# EAGLE design arm shield design (EAGLE 7.2.0)
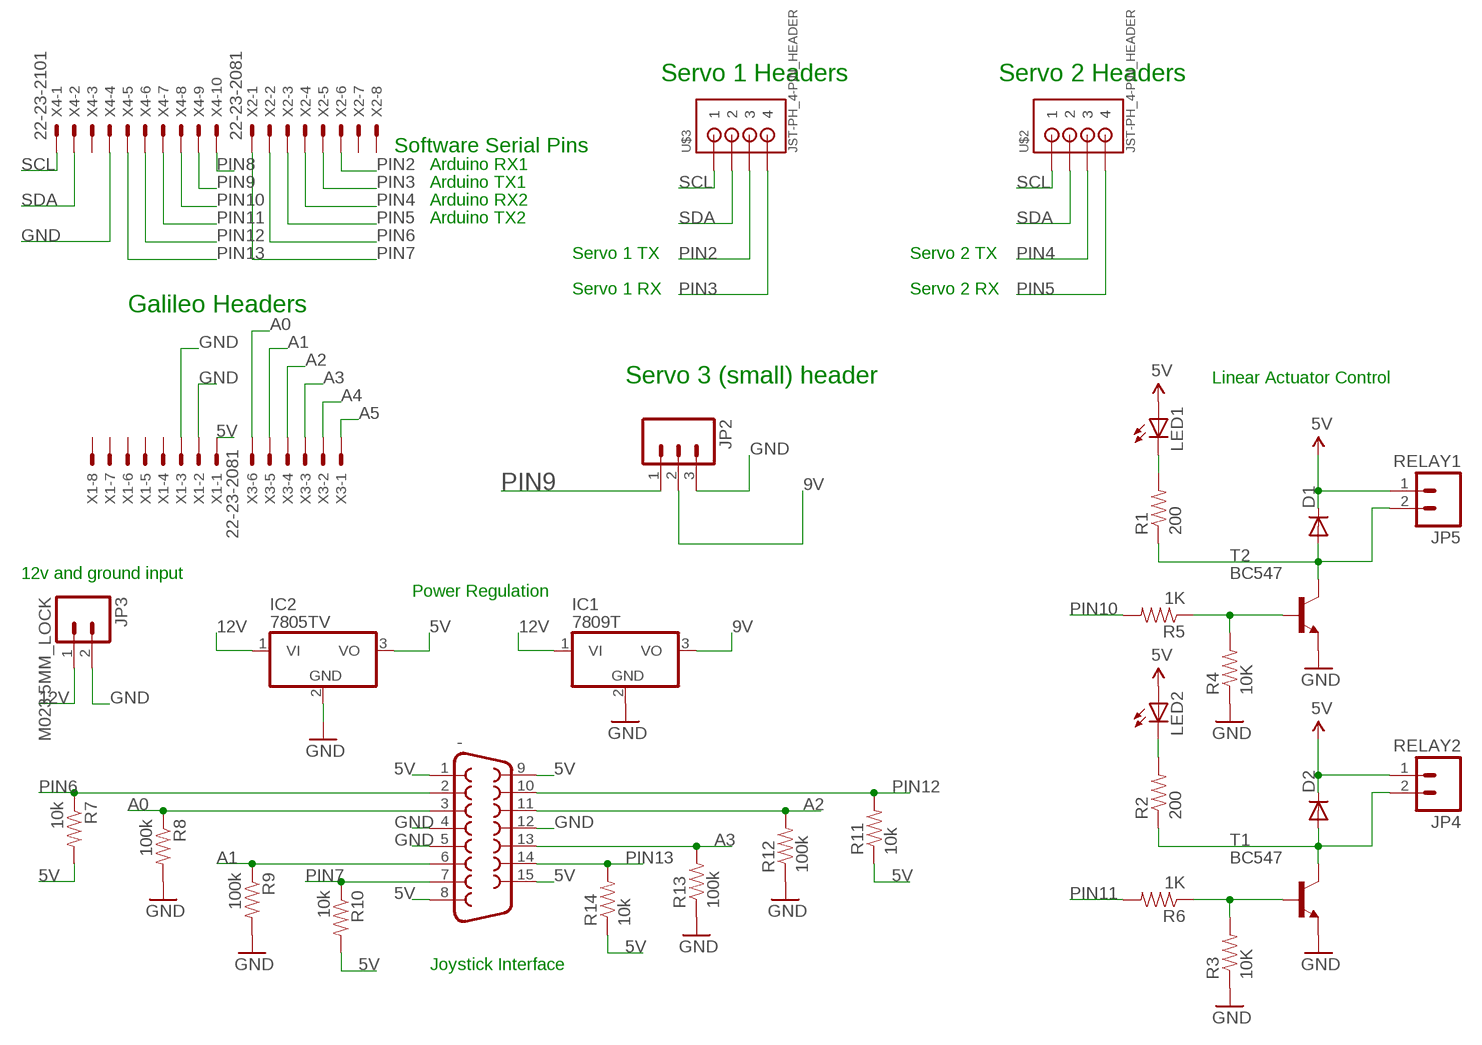
[diagram p0: schematic, sheet 1]

## Parts
-  F15HP  [F15HP]
D1  DIODE1N4148  [DIODE-1N4148]
D2  DIODE1N4148  [DIODE-1N4148]
IC1  7809T  7805TV  [TO220V]
IC2  7805TV  [TO220V]
JP2  M03PTH  [1X03]
JP3  M023.5MM_LOCK  [SCREWTERMINAL-3.5MM-2_LOCK]
JP4  RELAY2  M023.5MM_LOCK  [SCREWTERMINAL-3.5MM-2_LOCK]
JP5  RELAY1  M023.5MM_LOCK  [SCREWTERMINAL-3.5MM-2_LOCK]
LED1  LED3MM  [LED3MM]
LED2  LED3MM  [LED3MM]
R1  200  RESISTORPTH-1/4W-VERT  [AXIAL-0.1]
R2  200  RESISTORPTH-1/4W-VERT  [AXIAL-0.1]
R3  10K  RESISTORPTH-1/4W-VERT  [AXIAL-0.1]
R4  10K  RESISTORPTH-1/4W-VERT  [AXIAL-0.1]
R5  1K  RESISTORPTH-1/4W-VERT  [AXIAL-0.1]
R6  1K  RESISTORPTH-1/4W-VERT  [AXIAL-0.1]
R7  10k  RESISTORPTH-1/4W-VERT  [AXIAL-0.1]
R8  100k  RESISTORPTH-1/4W-VERT  [AXIAL-0.1]
R9  100k  RESISTORPTH-1/4W-VERT  [AXIAL-0.1]
R10  10k  RESISTORPTH-1/4W-VERT  [AXIAL-0.1]
R11  10k  RESISTORPTH-1/4W-VERT  [AXIAL-0.1]
R12  100k  RESISTORPTH-1/4W-VERT  [AXIAL-0.1]
R13  100k  RESISTORPTH-1/4W-VERT  [AXIAL-0.1]
R14  10k  RESISTORPTH-1/4W-VERT  [AXIAL-0.1]
T1  BC547  [TO92]
T2  BC547  [TO92]
U$2  JST-PH_4-PIN_HEADER  [JST_B4B-PH_HEADER]
U$3  JST-PH_4-PIN_HEADER  [JST_B4B-PH_HEADER]
X1  22-23-2081  [22-23-2081]
X2  22-23-2081  [22-23-2081]
X3  22-23-2061  [22-23-2061]
X4  22-23-2101  [22-23-2101]

## Nets
5V: -.1 -.8 -.9 -.15 D1.C D2.C IC2.3(VO) JP4.1 JP5.1 LED1.A LED2.A R7.P$2 R10.P$2 R11.P$1 R14.P$1 X1.1
9V [9VPower]: IC1.3(VO) JP2.2
12V [12VPower]: IC1.1(VI) IC2.1(VI) JP3.1
A0: -.3 R8.P$1 X3.6
A1: -.6 R9.P$1 X3.5
A2: -.11 R12.P$2 X3.4
A3: -.13 R13.P$2 X3.3
A4: X3.2
A5: X3.1
GND [12VPower]: -.4 -.5 -.12 IC1.2(GND) IC2.2(GND) JP2.3 JP3.2 R3.P$1 R4.P$1 R8.P$2 R9.P$2 R12.P$1 R13.P$1 T1.1(E) T2.1(E) X1.2 X1.3 X4.4
N$3: D1.A JP5.2 R1.P$1 T2.3(C)
N$4: D2.A JP4.2 R2.P$1 T1.3(C)
N$5: LED1.K(C) R1.P$2
N$6: R3.P$2 R6.P$1 T1.2(B)
N$7: LED2.K(C) R2.P$2
N$8: R4.P$2 R5.P$1 T2.2(B)
PIN2: U$3.P3 X2.6
PIN3: U$3.P4 X2.5
PIN4: U$2.P3 X2.4
PIN5: U$2.P4 X2.3
PIN6: -.2 R7.P$1 X2.2
PIN7: -.7 R10.P$1 X2.1
PIN8: X4.10
PIN9: JP2.1 X4.9
PIN10: R5.P$2 X4.8
PIN11: R6.P$2 X4.7
PIN12: -.10 R11.P$2 X4.6
PIN13: -.14 R14.P$2 X4.5
SCL: U$2.P1 U$3.P1 X4.1
SDA: U$2.P2 U$3.P2 X4.2
Unconnected: X1.4 X1.5 X1.6 X1.7 X1.8 X2.7 X2.8 X4.3

## Notes on the sheet
- Servo 1 Headers | Servo 2 Headers
- Software Serial Pins
- Arduino RX1
- Arduino TX1
- Arduino RX2
- Arduino TX2
- Servo 1 TX | Servo 2 TX
- Servo 1 RX | Servo 2 RX
- Galileo Headers
- Servo 3 (small) header | Linear Actuator Control
- 12v and ground input
- Power Regulation
- Joystick Interface

## Library data of the parts
- = con-subd:F15: SUB-D; OC_FARNELL: unknown; OC_NEWARK: unknown
D1 D2 = SparkFun-DiscreteSemi:DIODE: Diode These are standard reverse protection diodes and small signal diodes. SMA package can handle up to about 1A. SOD-323 can handle about 200mA. What the SOD-323 package when ordering, there are some mfgs out there that are 5-pin packages.
IC1 IC2 = linear:78*: Positive VOLTAGE REGULATOR Source: http://cache.national.com/ds/LM/LM78L05.pdf http://www.fairchildsemi.com/ds/LM/LM7805.pdf
JP2 = SparkFun-Connectors:M03: Header 3 Standard 3-pin 0.1" header. Use with straight break away headers (SKU : PRT-00116), right angle break away headers (PRT-00553), swiss pins (PRT-00743), machine pins (PRT-00117), and female headers (PRT-00115). Molex polarized connector foot print use with SKU : PRT-08232 with associated crimp pins and housings.
JP3-JP5 = SparkFun-Connectors:M02: Standard 2-pin 0.1" header. Use with - straight break away headers ( PRT-00116) - right angle break away headers (PRT-00553) - swiss pins (PRT-00743) - machine pins (PRT-00117) - female headers (PRT-00115) Molex polarized connector foot print use with: PRT-08233 with associated crimp pins and housings. 2.54_SCREWTERM for use with PRT-10571. 3.5mm Screw Terminal footprints for PRT-08084 5mm Screw Terminal footprints for use with PRT-08433
LED1 LED2 = SparkFun-LED:LED: LEDs Standard schematic elements and footprints for 5mm, 3mm, 1206, and 0603 sized LEDs. 5mm - Spark Fun Electronics SKU : COM-00529 (and others)
R1-R14 = SparkFun-Resistors:RESISTOR: Resistor Basic schematic elements and footprints for 0603, 1206, and PTH resistors.
T1 T2 = transistor:BC547: NPN TRANSISTOR
U$2 U$3 = SRG:JST-PH_4-PIN_HEADER: 4-pin JST PH Shrouded Header, top entry P/N B4B-PH-K-S Mating connector PHR-4 Mating cable assembly: Sparkfun PRT-09916 <http://www.sparkfun.com/products/9916>; MPN: S4B-PH-K-S(LF)(SN)
X1 X2 = con-molex:22-23-2081: .100" (2.54mm) Center Header - 8 Pin; MF: MOLEX; MPN: 22-23-2081; OC_FARNELL: 1756826; OC_NEWARK: 01C7592
X3 = con-molex:22-23-2061: .100" (2.54mm) Center Header - 6 Pin; MF: MOLEX; MPN: 22-23-2061; OC_FARNELL: 1462922; OC_NEWARK: 27C1933
X4 = con-molex:22-23-2101: .100" (2.54mm) Center Header - 10 Pin; MF: MOLEX; MPN: 22-23-2101; OC_FARNELL: 1756828; OC_NEWARK: 94C0765

## Net classes
0 default: width 1.016 mm
1 12VPower: width 2.032 mm
2 9VPower: width 2.032 mm

## Board
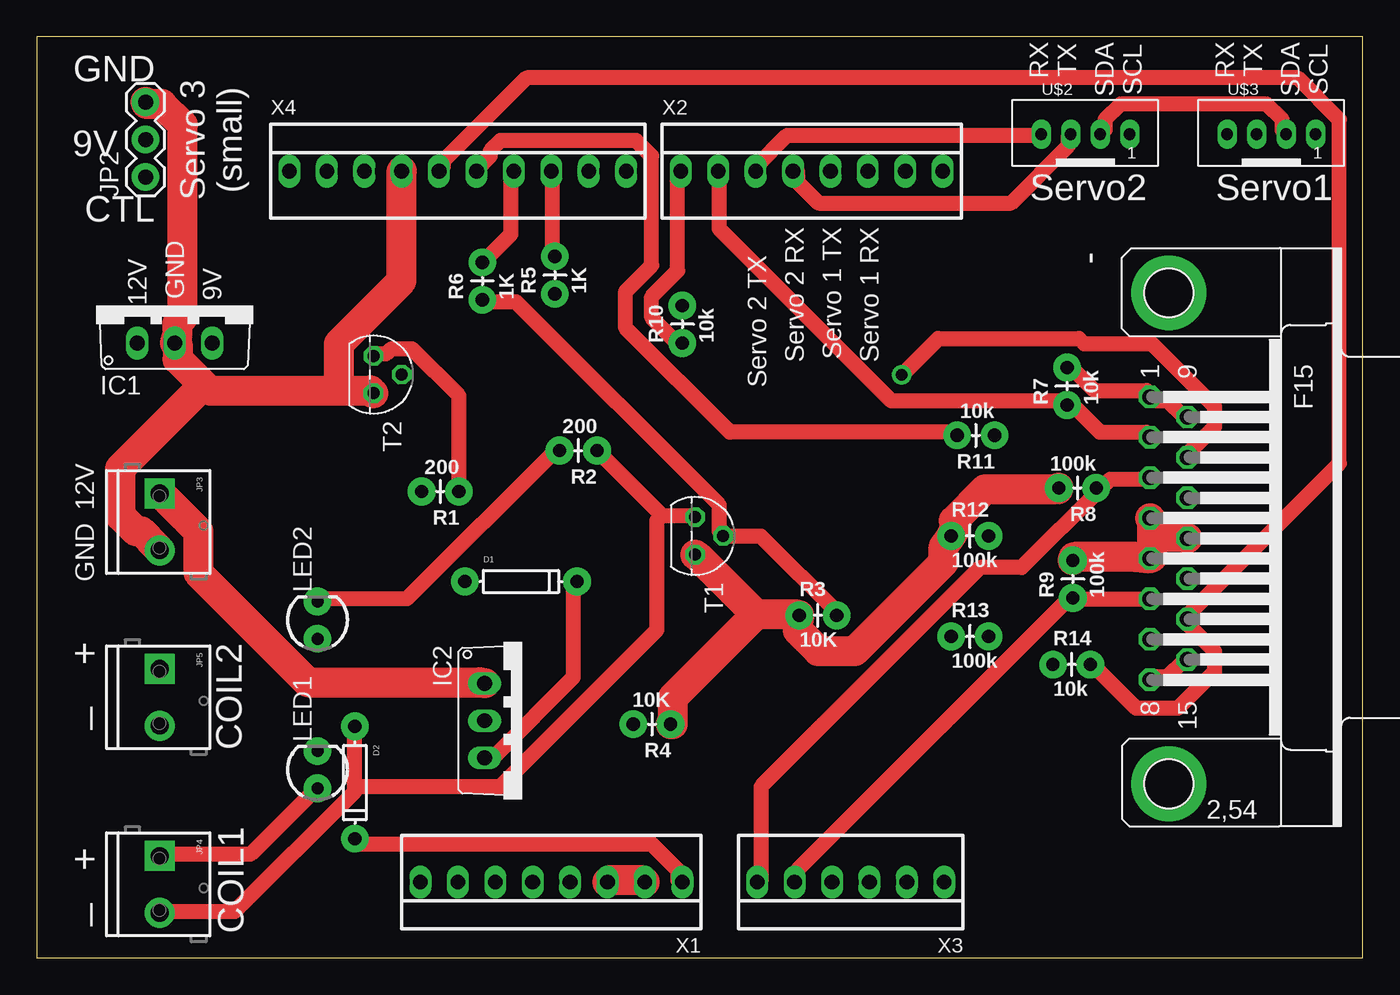
[diagram p1: board, top side]
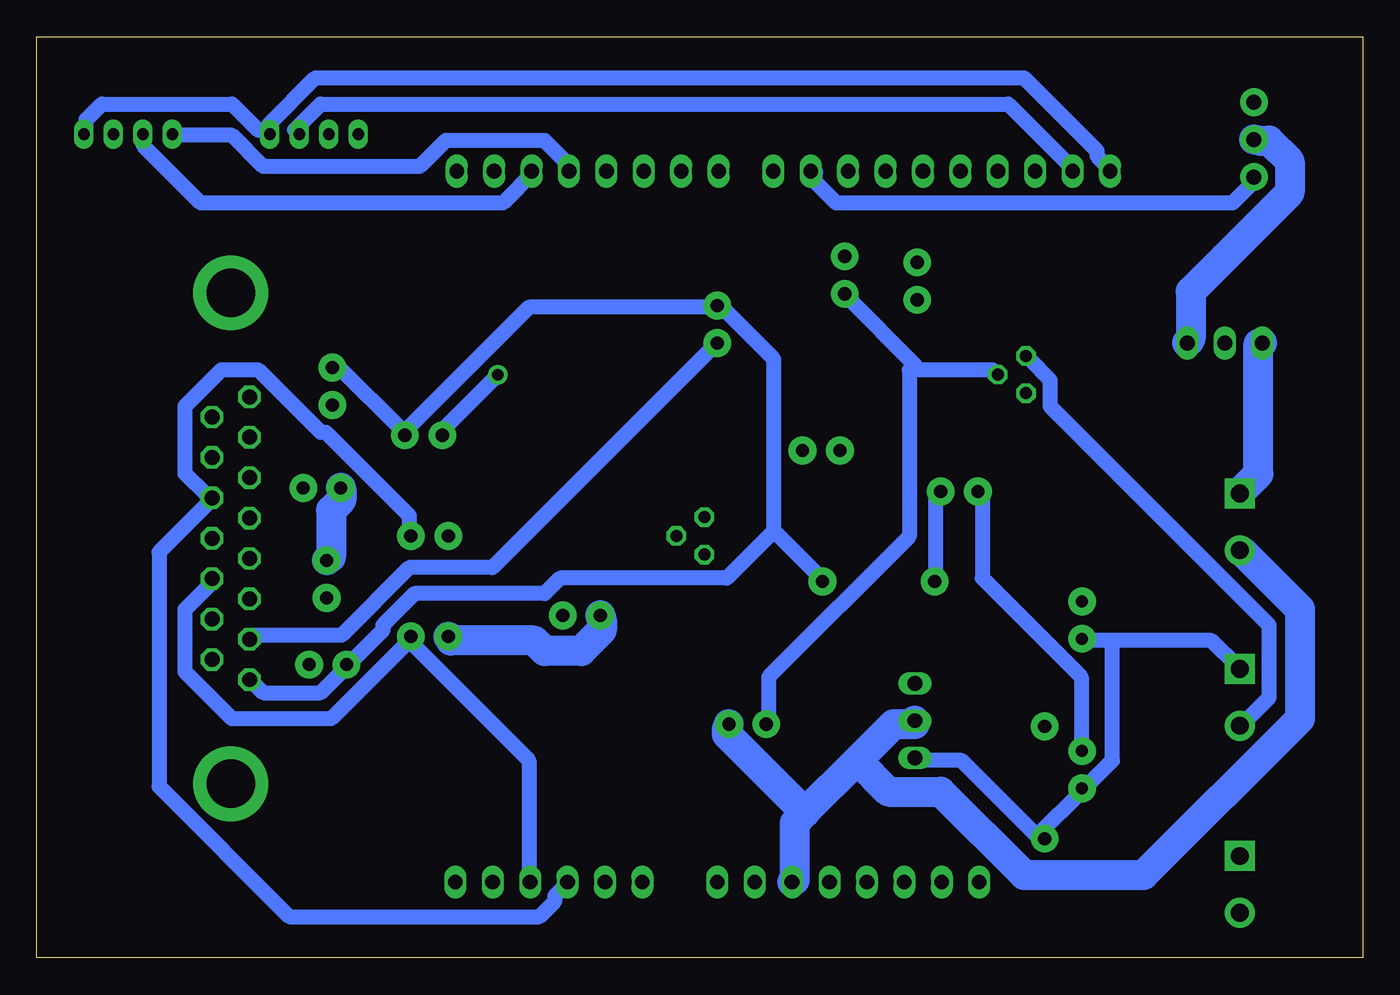
[diagram p2: board, bottom side, seen from below]

Size 90 x 62.54 mm. Coordinates in mm from the lower left corner, seen from the top.
Outline: 0,0 90,0 90,62.54 0,62.54 0,0
Copper layers (1*16): Top 0.035mm / dielectric 1.5mm / Bottom 0.035mm
Design rules "Othermill-DRC-1-64": minimum track width 8mil, minimum drill 0.8mm, track to track 0.39878125mm, track to pad 0.39878125mm, pad to pad 0.39878125mm, via to via 0.39878125mm, smd to smd 0mil, copper to edge 0mil, drill to drill 1mil, minimum pad ring 10mil, minimum via ring 10mil, stop-mask expansion 1mil, vias tented up to drill 30mil, thermal gap 10mil

### Footprints (pad centres in the part's own frame; a part is rotated, then mirrored left to right if it is on the bottom)
F15HP = drill 1.016 octagon: 1 -9.601,-1.27; 2 -6.858,-1.27; 3 -4.115,-1.27; 4 -1.372,-1.27; 5 1.372,-1.27; 6 4.115,-1.27; 7 6.858,-1.27; 8 9.601,-1.27; 9 -8.23,1.27; 10 -5.486,1.27; 11 -2.743,1.27; 12 0,1.27; 13 2.743,1.27; 14 5.486,1.27; 15 8.23,1.27 | drill 3.302 pad 5.08: G1 -16.662,0; G2 16.662,0
DIODE-1N4148 = drill 0.9 pad 1.88: A -3.81,0; C 3.81,0
TO220V = drill 1.016 long: 1 -2.54,-2.54; 2 0,-2.54; 3 2.54,-2.54
1X03 = drill 1.016 pad 1.88: 1 0,0; 2 2.54,0; 3 5.08,0
SCREWTERMINAL-3.5MM-2_LOCK = drill 1.2 pad 2.032 square: 1 -0.178,0 | drill 1.2 pad 2.032: 2 3.678,0
LED3MM = drill 0.813 pad 1.88: A -1.27,0; K 1.27,0
AXIAL-0.1 = drill 0.9 pad 1.88: P$1 0,0; P$2 2.54,0
TO92 = drill 0.813 octagon: 1 1.27,0; 2 0,1.905; 3 -1.27,0
JST_B4B-PH_HEADER = drill 0.8 long: P1 2.98,0.048; P2 0.98,0.048; P3 -1.02,0.048; P4 -3.02,0.048
22-23-2081 = drill 1 long: 1 -8.89,0; 2 -6.35,0; 3 -3.81,0; 4 -1.27,0; 5 1.27,0; 6 3.81,0; 7 6.35,0; 8 8.89,0
22-23-2061 = drill 1 long: 1 -6.35,0; 2 -3.81,0; 3 -1.27,0; 4 1.27,0; 5 3.81,0; 6 6.35,0
22-23-2101 = drill 1 long: 1 -11.43,0; 2 -8.89,0; 3 -6.35,0; 4 -3.81,0; 5 -1.27,0; 6 1.27,0; 7 3.81,0; 8 6.35,0; 9 8.89,0; 10 11.43,0

### Placement (x,y rotation side)
-  76.83,28.5 270 top
D1  32.86,25.56 0 top
D2  21.59,11.91 270 top
IC1  9.37,44.29 0 top
IC2  32.94,16.11 270 top
JP2  7.38,53.02 90 top
JP3  8.33,31.35 270 top
JP4  8.33,6.75 270 top
JP5  8.33,19.45 270 top
LED1  19.05,12.78 90 top
LED2  19.05,22.94 90 top
R1  28.65,31.67 180 top
R2  38.02,34.45 180 top
R3  51.75,23.26 0 top
R4  43.02,15.88 180 top
R5  35.16,45.08 90 top
R6  30.24,44.69 90 top
R7  69.93,37.54 90 top
R8  71.91,31.91 180 top
R9  70.33,24.45 90 top
R10  43.81,41.75 90 top
R11  65.01,35.48 180 top
R12  62.07,28.65 0 top
R13  62.07,21.83 0 top
R14  68.98,19.92 0 top
T1  44.69,28.65 270 top
T2  22.86,39.61 270 top
U$2  71.2,55.88 0 top
U$3  83.82,55.88 0 top
X1  34.92,5.16 180 top
X2  52.6,53.42 0 top
X3  55.24,5.16 180 top
X4  28.57,53.42 0 top

### Tracks (layer width: path | path; a pad name or v marks a point on that pad's centre or on a via)
5V
  Top 1.016: -.9 77.81,36.76 76.75,37.82 75.69,37.82 -.1 75.34,38.53 71.8,38.53 70.03,40.29 R7.P$2 | -.8 75.69,19.07 76.75,19.07 77.81,20.13 -.15 | X1.1 43.5,5.28 43.5,5.99 41.74,7.75 21.93,7.75 D2.C | D1.C 36.43,25.44 36.43,19.07 31.12,13.77 30.42,13.77 IC2.3 | JP4.1 8.49,7.05 14.5,7.05 18.75,11.29 LED1.A
  Bottom 1.016: R7.P$2 69.68,40.29 65.08,35.7 R11.P$1 64.73,36.05 56.59,44.19 44.21,44.19 R10.P$2 43.5,44.19 39.97,40.65 39.97,28.98 | 16.98,21.55 10.26,21.55 8.49,19.78 JP5.1 | 16.98,21.55 18.75,21.55 LED2.A | -.8 75.34,18.72 74.63,18.01 70.74,18.01 69.32,19.43 69.32,19.78 R14.P$1 68.62,20.13 66.49,22.26 66.49,22.61 64.37,24.73 55.53,24.73 54.47,25.79 43.15,25.79 39.97,28.98 | IC2.3 30.06,13.41 27.23,13.41 21.93,8.11 D2.C 21.93,8.46 19.1,11.29 LED1.A 18.75,11.65 16.98,13.41 16.98,21.55 | 39.97,28.98 36.78,25.79 D1.C
9V
  Bottom 2.032: IC1.3 11.67,42.06 11.67,45.25 4.95,51.97 4.95,54.09 6.37,55.5 7.07,55.5 JP2.2
12V
  Top 2.032: IC2.1 30.06,18.72 18.39,18.72 10.96,26.15 10.96,28.98 8.49,31.45 JP3.1
  Bottom 2.032: IC1.1 7.07,41.71 7.07,32.87 8.13,31.81 JP3.1
A0
  Top 1.016: X3.6 49.16,5.28 49.16,11.65 64.02,26.5 66.85,26.5 72.15,31.81 R8.P$1 72.51,32.16 72.86,32.51 75.34,32.51 -.3
A1
  Top 1.016: X3.5 51.64,5.28 51.64,5.99 70.03,24.38 R9.P$1 70.74,24.38 75.34,24.38 -.6
A2
  Bottom 1.016: X3.4 54.12,4.93 54.82,4.22 54.82,3.86 55.88,2.8 72.86,2.8 81.7,11.65 81.7,27.56 78.17,31.1 -.11 78.52,31.45 79.94,32.87 79.94,37.47 77.46,39.94 74.98,39.94 70.74,35.7 70.39,35.7 64.73,30.04 64.73,28.98 R12.P$2
A3
  Bottom 1.016: X3.3 56.59,5.28 56.59,13.41 64.73,21.55 R13.P$2 65.08,21.2 70.03,16.24 76.75,16.24 79.94,19.43 79.94,23.67 78.17,25.44 -.13
GND
  Top 2.032: 20.51,38.53 11.67,38.53 11.32,38.88 | 20.51,38.53 22.64,38.53 T2.1 | 11.32,38.88 9.55,40.65 9.55,41.71 IC1.2 9.55,42.42 9.55,43.12 9.9,43.48 9.9,56.56 8.49,57.98 7.43,57.98 JP2.3 | 20.51,38.53 20.51,41.71 24.76,45.95 24.76,53.38 X4.4 | 11.32,38.88 5.66,33.22 5.66,30.04 6.72,28.98 7.07,28.98 8.13,27.92 JP3.2 | X1.3 38.91,5.28 41.03,5.28 X1.2 | 75.69,28.62 75.69,29.68 -.4 | 75.69,28.62 75.69,27.21 -.5 74.63,27.21 70.39,27.21 R9.P$2 | 75.69,28.62 77.81,28.62 -.12 | R8.P$2 69.32,31.81 64.37,31.81 62.25,29.68 62.25,28.98 R12.P$1 61.54,27.92 61.54,26.85 55.53,20.84 53.05,20.84 51.64,22.26 R3.P$1 51.64,23.32 48.81,23.32 | 48.81,23.32 44.92,27.21 T1.1 | 48.81,23.32 43.15,17.66 43.15,15.89 R4.P$1
  Bottom 2.032: 37.84,9.88 38.55,9.17 38.55,5.28 X1.3 | 37.84,9.88 34.31,13.41 | 34.31,13.41 31.83,15.89 30.42,15.89 IC2.2 | 37.84,9.88 43.15,15.18 43.15,15.54 R4.P$1 | R9.P$2 70.03,27.21 70.03,30.39 69.32,31.1 69.32,31.81 R8.P$2 | R13.P$1 61.9,21.55 56.24,21.55 55.53,20.84 53.05,20.84 51.64,22.26 51.64,22.96 R3.P$1 | 34.31,13.41 32.19,11.29 28.65,11.29 22.99,5.63 14.86,5.63 4.24,16.24 4.24,23.67 8.13,27.56 JP3.2
N$3
  Top 1.016: T2.3 22.99,41 23.7,41 24.05,41.36 25.47,41.36 28.65,38.17 28.65,31.81 R1.P$1
  Bottom 1.016: D1.A 29,25.79 29,31.45 R1.P$1 | JP5.2 8.13,15.89 6.37,17.66 6.37,22.61 21.22,37.47 21.22,39.23 22.64,40.65 T2.3
N$4
  Top 1.016: 42.44,30.04 44.56,30.04 T1.3 | 42.44,30.04 38.2,34.28 R2.P$1 | 21.57,11.65 21.57,11.29 13.44,3.16 8.49,3.16 JP4.2 | 21.57,11.65 21.57,15.54 D2.A | 21.57,11.65 31.48,11.65 42.09,22.26 42.09,29.68 42.44,30.04
N$5
  Bottom 1.016: LED1.K 19.1,14.12 19.1,19.07 25.82,25.79 25.82,31.45 R1.P$2
N$6
  Top 1.016: R3.P$2 54.47,23.32 49.16,28.62 46.69,28.62 T1.2 46.33,28.98 46.33,30.75 32.54,44.54 30.42,44.54 R6.P$1
N$7
  Top 1.016: LED2.K 19.1,24.38 25.11,24.38 35.37,34.64 R2.P$2
N$8
  Bottom 1.016: 30.42,40.29 35.02,44.89 R5.P$1 | 30.42,40.29 30.06,39.94 25.11,39.94 T2.2 | R4.P$2 40.32,15.89 40.32,19.07 30.77,28.62 30.77,39.94 30.42,40.29
PIN2
  Bottom 1.016: U$3.P3 82.76,55.86 82.76,55.15 78.87,51.26 58.36,51.26 56.24,53.38 X2.6
PIN3
  Bottom 1.016: U$3.P4 80.64,55.86 76.75,55.86 74.63,53.74 64.02,53.74 62.25,55.5 55.53,55.5 53.76,53.74 X2.5
PIN4
  Top 1.016: U$2.P3 70.03,55.86 70.03,55.15 66.14,51.26 53.05,51.26 51.64,52.67 51.64,53.38 X2.4
PIN5
  Top 1.016: U$2.P4 67.91,55.86 50.93,55.86 48.81,53.74 X2.3
PIN6
  Top 1.016: X2.2 46.33,53.38 46.33,49.49 58.01,37.82 69.68,37.82 R7.P$1 70.39,37.47 72.15,35.7 75.34,35.7 -.2
PIN7
  Top 1.016: X2.1 43.5,53.38 43.5,46.66 41.74,44.89 41.74,43.48 43.5,41.71 R10.P$1
  Bottom 1.016: -.7 75.34,21.9 69.32,21.9 64.73,26.5 59.07,26.5 43.86,41.71 R10.P$1
PIN9
  Bottom 1.016: X4.9 37.14,53.38 37.14,52.67 35.72,51.26 8.84,51.26 7.43,52.67 JP2.1
PIN10
  Top 1.016: X4.8 35.02,53.38 35.02,47.72 R5.P$2
PIN11
  Top 1.016: X4.7 32.19,53.38 32.19,49.14 30.42,47.37 R6.P$2
PIN12  (via drill 0.8)
  Top 1.016: X4.6 30.06,53.74 30.77,54.44 30.77,54.8 31.48,55.5 40.67,55.5 41.74,54.44 41.74,47.01 39.97,45.25 39.97,42.77 47.04,35.7 62.25,35.7 R11.P$2 | v58.71,39.59 61.19,42.06 70.74,42.06 71.09,41.71 75.69,41.71 79.94,37.47 79.94,36.05 78.17,34.28 -.10
  Bottom 1.016: v58.71,39.59 62.6,35.7 R11.P$2
PIN13
  Top 1.016: X4.5 27.59,53.74 27.59,54.09 33.25,59.75 85.59,59.75 88.42,56.92 88.42,33.57 78.17,23.32 -.14 78.17,22.61 79.94,20.84 79.94,19.43 77.46,16.95 74.63,16.95 71.8,19.78 R14.P$2
SCL
  Bottom 1.016: U$3.P1 86.66,56.21 86.66,56.92 85.59,57.98 76.75,57.98 74.98,56.21 74.28,56.21 U$2.P1 74.28,56.56 71.09,59.75 22.99,59.75 18.04,54.8 18.04,54.44 17.33,53.74 X4.1
SDA
  Top 1.016: U$2.P2 72.51,56.21 72.51,56.92 73.57,57.98 83.47,57.98 84.53,56.92 84.53,56.21 U$3.P2
  Bottom 1.016: X4.2 19.81,53.74 24.05,57.98 70.74,57.98 72.51,56.21 U$2.P2

### Text on the board
tNames: GND | RX | TX | RX | TX | SDA | SCL | SDA | SCL | 9V | Servo 3 / (small) | CTL | Servo2 | Servo1 | Servo 2 RX | Servo 1 TX | Servo 1 RX | GND | 12V | 9V | Servo 2 TX | 12V | GND | COIL2 | + | _ | + | _ | COIL1